# EAGLE schematic ADC I2C (EAGLE 7.7.0)
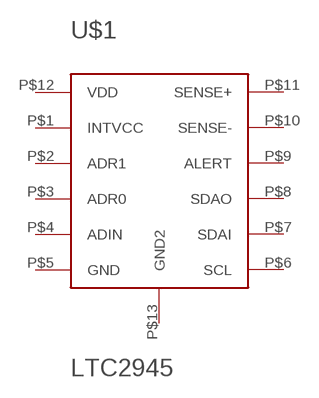
[diagram p0: schematic, sheet 1]

## Parts
U$1  LTC2945  [QFN12]
Unconnected: U$1.P$1(INTVCC) U$1.P$2(ADR1) U$1.P$3(ADR0) U$1.P$4(ADIN) U$1.P$5(GND) U$1.P$6(SCL) U$1.P$7(SDAI) U$1.P$8(SDAO) U$1.P$9(ALERT) U$1.P$10(SENSE-) U$1.P$11(SENSE+) U$1.P$12(VDD) U$1.P$13(GND2)

## Library data of the parts
U$1 = Raj:LTC2945: LTC2945 Wide Range I2C Power Monitor